# Altium schematic sheet B_conn_1P25A.SchDoc
size A; SheetNumber: 3; SheetTotal: 17
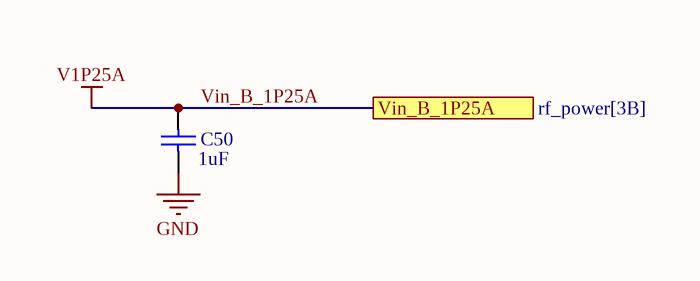
[diagram p0: B_conn_1P25A.SchDoc]

## Parts
C50  value 1uF  [CAPC2013X145X50LL20T25]  (hidden comment: C0805C105K4PACTU)

## Ports
Vin_B_1P25A (see rf_power[3B])

## Nets
GND: C50.1
Vin_B_1P25A: C50.2 ; port Vin_B_1P25A  [also labelled V1P25A]

## Library data of the parts
C50 = CMP-1036-04746-2: Manufacturer: Kemet; Part Number: C0805C105K4PACTU